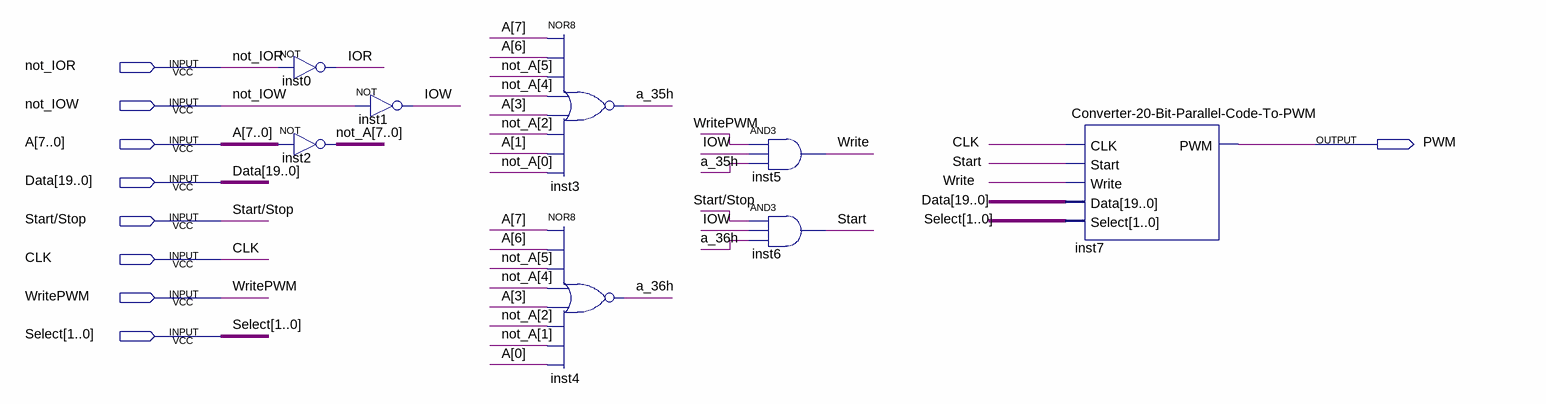
[diagram p0: schematic sheet]
// Quartus schematic CourseWork.bdf as structural Verilog: 8 symbols, 9 pins
module CourseWork (
  input  not_IOR,
  input  not_IOW,
  input  [7:0] A,
  input  [19:0] Data,
  input  \Start/Stop ,
  input  CLK,
  input  WritePWM,
  input  [1:0] Select,
  output PWM
);

  wire a_35h, a_36h, IOR, IOW, Start, Write;
  wire [7:0] not_A;

  not inst0 (IOR, not_IOR);
  assign not_A = ~A;  // NOT inst2, 8 bits wide
  not inst1 (IOW, not_IOW);
  nor inst3 (a_35h, A[7], A[6], not_A[5], not_A[4], A[3], not_A[2], A[1], not_A[0]);
  nor inst4 (a_36h, A[7], A[6], not_A[5], not_A[4], A[3], not_A[2], not_A[1], A[0]);
  and inst5 (Write, WritePWM, IOW, a_35h);
  and inst6 (Start, \Start/Stop , IOW, a_36h);
  \Converter-20-Bit-Parallel-Code-To-PWM  inst7 (
    .CLK(CLK), .Start(Start), .Write(Write), .Data(Data), .Select(Select), .PWM(PWM));
endmodule
